# Altium schematic sheet heater_control.SchDoc: Heater Control
size Tabloid; DocumentNumber: LM-003; Revision: 3.0; SheetNumber: 6; SheetTotal: 11
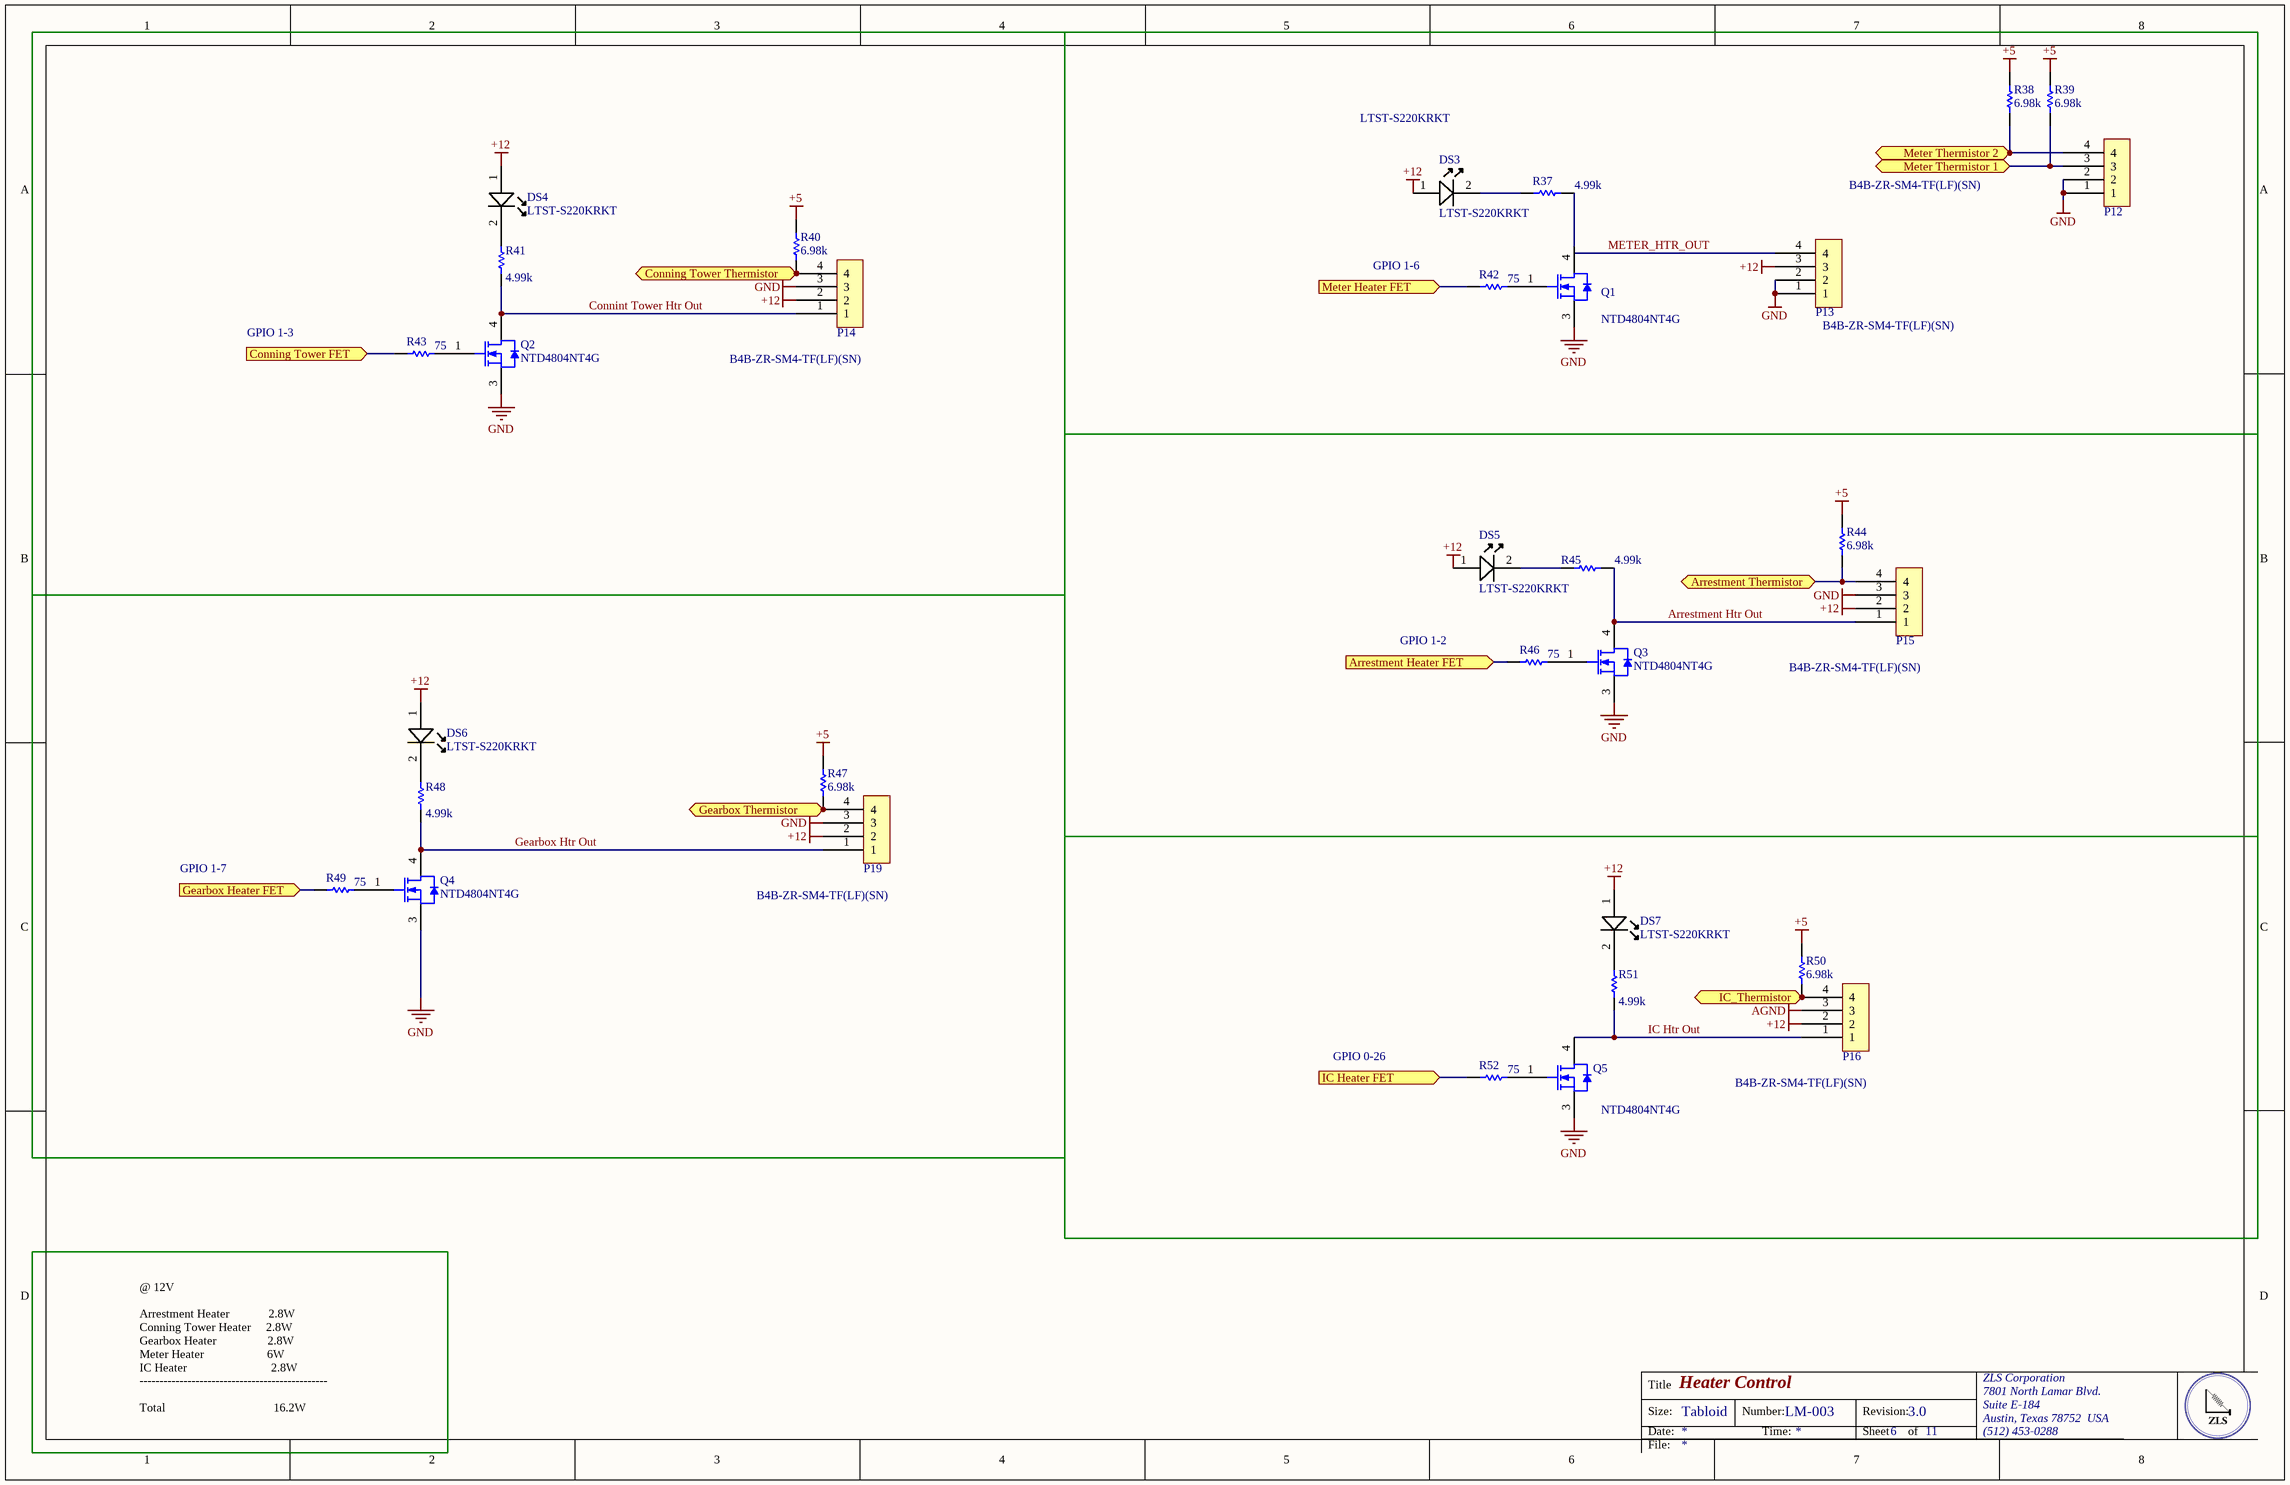
[diagram p0: heater_control.SchDoc]

## Parts
DS3  Manufacturer Part Number: LTST-S220KRKT  [0805C_L]  (hidden comment: Visible Name Value Type    False Description Lite-On LTST-S220KRKT Red LED, 631 nm 2012 (0805) Side View, Rectangle Lens SMD package STRING)
DS4  Manufacturer Part Number: LTST-S220KRKT  [0805C_L]  (hidden comment: Visible Name Value Type    False Description Lite-On LTST-S220KRKT Red LED, 631 nm 2012 (0805) Side View, Rectangle Lens SMD package STRING)
DS5  Manufacturer Part Number: LTST-S220KRKT  [0805C_L]  (hidden comment: Visible Name Value Type    False Description Lite-On LTST-S220KRKT Red LED, 631 nm 2012 (0805) Side View, Rectangle Lens SMD package STRING)
DS6  Manufacturer Part Number: LTST-S220KRKT  [0805C_L]  (hidden comment: Visible Name Value Type    False Description Lite-On LTST-S220KRKT Red LED, 631 nm 2012 (0805) Side View, Rectangle Lens SMD package STRING)
DS7  Manufacturer Part Number: LTST-S220KRKT  [0805C_L]  (hidden comment: Visible Name Value Type    False Description Lite-On LTST-S220KRKT Red LED, 631 nm 2012 (0805) Side View, Rectangle Lens SMD package STRING)
P12  Manufacturer Part Number: B4B-ZR-SM4-TF(LF)(SN)  [B4B-ZR-SM4-TF]  (hidden comment: CONN HEADER ZH TOP 4POS 1.5MM)
P13  Manufacturer Part Number: B4B-ZR-SM4-TF(LF)(SN)  [B4B-ZR-SM4-TF]  (hidden comment: CONN HEADER ZH TOP 4POS 1.5MM)
P14  Manufacturer Part Number: B4B-ZR-SM4-TF(LF)(SN)  [B4B-ZR-SM4-TF]  (hidden comment: CONN HEADER ZH TOP 4POS 1.5MM)
P15  Manufacturer Part Number: B4B-ZR-SM4-TF(LF)(SN)  [B4B-ZR-SM4-TF]  (hidden comment: CONN HEADER ZH TOP 4POS 1.5MM)
P16  Manufacturer Part Number: B4B-ZR-SM4-TF(LF)(SN)  [B4B-ZR-SM4-TF]  (hidden comment: CONN HEADER ZH TOP 4POS 1.5MM)
P19  Manufacturer Part Number: B4B-ZR-SM4-TF(LF)(SN)  [B4B-ZR-SM4-TF]  (hidden comment: CONN HEADER ZH TOP 4POS 1.5MM)
Q1  NTD4804NT4G  [ONSC-DPAK-3-369AA-01_V]
Q2  NTD4804NT4G  [ONSC-DPAK-3-369AA-01_V]
Q3  NTD4804NT4G  [ONSC-DPAK-3-369AA-01_V]
Q4  NTD4804NT4G  [ONSC-DPAK-3-369AA-01_V]
Q5  NTD4804NT4G  [ONSC-DPAK-3-369AA-01_V]
R37  Resistance (Ohms): 4.99k  [RESC0805(2012)_L]
R38  Resistance (Ohms): 6.98k  [RESC0805(2012)_N]  (hidden comment: 6K98 1% 0805(2012))
R39  Resistance (Ohms): 6.98k  [RESC0805(2012)_N]  (hidden comment: 6K98 1% 0805(2012))
R40  Resistance (Ohms): 6.98k  [RESC0805(2012)_N]  (hidden comment: 6K98 1% 0805(2012))
R41  Resistance (Ohms): 4.99k  [RESC0805(2012)_L]
R42  Resistance (Ohms): 75  [RESC0805(2012)_L]
R43  Resistance (Ohms): 75  [RESC0805(2012)_L]
R44  Resistance (Ohms): 6.98k  [RESC0805(2012)_N]  (hidden comment: 6K98 1% 0805(2012))
R45  Resistance (Ohms): 4.99k  [RESC0805(2012)_L]
R46  Resistance (Ohms): 75  [RESC0805(2012)_L]
R47  Resistance (Ohms): 6.98k  [RESC0805(2012)_N]  (hidden comment: 6K98 1% 0805(2012))
R48  Resistance (Ohms): 4.99k  [RESC0805(2012)_L]
R49  Resistance (Ohms): 75  [RESC0805(2012)_L]
R50  Resistance (Ohms): 6.98k  [RESC0805(2012)_N]  (hidden comment: 6K98 1% 0805(2012))
R51  Resistance (Ohms): 4.99k  [RESC0805(2012)_L]
R52  Resistance (Ohms): 75  [RESC0805(2012)_L]

## Blocks framed on the sheet
GPIO 1-3: DS4 P14 Q2 R40 R41 R43
GPIO 1-2: DS5 P15 Q3 R44-R46
GPIO 1-7: DS6 P19 Q4 R47-R49
GPIO 0-26: DS7 P16 Q5 R50-R52

## Ports
Arrestment Heater FET (in), Arrestment Thermistor, Conning Tower FET (in), Conning Tower Thermistor (out), Gearbox Heater FET (in), Gearbox Thermistor (out), IC Heater FET (in), IC_Thermistor, Meter Heater FET (in), Meter Thermistor 1, Meter Thermistor 2

## Nets
+5: R38.1 R39.2 R40.2 R44.1 R47.2 R50.1
+12: DS3.1(A) DS4.1(A) DS5.1(A) DS6.1(A) DS7.1(A) P13.3 P14.2 P15.2 P16.2 P19.2
AGND: P16.3
GND: P12.1 P12.2 P13.1 P13.2 P14.3 P15.3 P19.3 Q1.3(S) Q2.3(S) Q3.3(S) Q4.3(S) Q5.3(S)
Arrestment Heater FET: R46.1 ; port Arrestment Heater FET
Arrestment Htr Out: P15.1 Q3.4(D) R45.2
Arrestment Thermistor: P15.4 R44.2 ; port Arrestment Thermistor
Conning Tower FET: R43.1 ; port Conning Tower FET
Conning Tower Thermistor: P14.4 R40.1 ; port Conning Tower Thermistor
Connint Tower Htr Out: P14.1 Q2.4(D) R41.1
Gearbox Heater FET: R49.1 ; port Gearbox Heater FET
Gearbox Htr Out: P19.1 Q4.4(D) R48.1
Gearbox Thermistor: P19.4 R47.1 ; port Gearbox Thermistor
IC Heater FET: R52.1 ; port IC Heater FET
IC Htr Out: P16.1 Q5.4(D) R51.2
IC_Thermistor: P16.4 R50.2 ; port IC_Thermistor
Meter Heater FET: R42.1 ; port Meter Heater FET
Meter Thermistor 1: P12.3 R39.1 ; port Meter Thermistor 1
Meter Thermistor 2: P12.4 R38.2 ; port Meter Thermistor 2
METER_HTR_OUT: P13.4
NetDS3_2: DS3.2(K) R37.1
NetDS4_2: DS4.2(K) R41.2
NetDS5_2: DS5.2(K) R45.1
NetDS6_2: DS6.2(K) R48.2
NetDS7_2: DS7.2(K) R51.1
NetQ1_1: Q1.1(G) R42.2
NetQ1_4: Q1.4(D) R37.2
NetQ2_1: Q2.1(G) R43.2
NetQ3_1: Q3.1(G) R46.2
NetQ4_1: Q4.1(G) R49.2
NetQ5_1: Q5.1(G) R52.2

Not connected (* = marked no-connect by the designer): P12 5 6; P13 5 6; P14 5 6; P15 5 6; P16 5 6; P19 5 6

## Notes on the sheet
- LTST-S220KRKT
- GPIO 1-6
- @ 12V
  Arrestment Heater             2.8W
  Conning Tower Heater     2.8W
  Gearbox Heater                 2.8W
  Meter Heater                     6W
  IC Heater                            2.8W
  -----------------------------------------------
  Total                                    16.2W
- Title
- Size:
- Date:
- Tabloid
- Number:
- Time:
- Revision:
- Sheet
- of
- ZLS Corporation
- 7801 North Lamar Blvd.
- Suite E-184
- Austin, Texas 78752  USA
- (512) 453-0288
- File:

## Library data of the parts
DS3-DS7 = LED A/K: Manufacturer: Vishay / Lite-On; Lens Colour: Colorless; Lens Style: Diffused,Colorless; Viewing Angle: 130°; Luminous Intensity: 54mcd; Forward Current: 20mA; Forward Voltage: 2V; Power Rating: 75mW; Dominant Wavelength: 631nm; Lens Transparency: Clear; Number of Elements: 1; Wavelength: 639nm; Supplier 1: Digi-Key; Supplier Part Number 1: 160-1469-1-ND; Stock 1: 108191; Pricing 1: 1=0.31, 10=0.225, 25=0.1656, 100=0.1183, 250=0.0804, 500=0.071, 1000=0.0556 (USD); Mount: Surface Mount; Case/Package: 0805; Number of Pins: 2; Colour: Red; Case Code (Metric): 2012; Case Code (Imperial): 0805; Min Operating Temperature: -55°C; Max Operating Temperature: 85°C; Packaging: Tape and Reel; Package Quantity: 4000; Illumination Colour: Red; Test Current: 20mA; Power Dissipation: 75mW; Number of LEDs: 1; Length: 2.1mm; Height: 0.6mm; Width: 1mm; Depth: 0.6mm; Radiation Hardening: No; Lead Free: Lead Free; ComponentLink1URL: https://datasheet.ciiva.com/2110/s-110-ltst-s220krkt-2110132.pdf; ComponentLink1Description: https://datasheet.ciiva.com/2110/s-110-ltst-s220krkt-2110132.pdf; ComponentLink2URL: https://datasheet.ciiva.com/2110/s-110-ltst-s220krkt-2110133.pdf; ComponentLink2Description: https://datasheet.ciiva.com/2110/s-110-ltst-s220krkt-2110133.pdf; ComponentLink3URL: https://datasheet.ciiva.com/2110/s-110-ltst-s220krkt-2110134.pdf; ComponentLink3Description: https://datasheet.ciiva.com/2110/s-110-ltst-s220krkt-2110134.pdf; ComponentLink4URL: https://datasheet.ciiva.com/12403/lite-on-ltst-s220krkt-187389-12403798.pdf; ComponentLink4Description: https://datasheet.ciiva.com/12403/lite-on-ltst-s220krkt-187389-12403798.pdf; ComponentLink5URL: https://datasheet.ciiva.com/16345/lite-onltst-s220krkt-16345511.pdf; ComponentLink5Description: https://datasheet.ciiva.com/16345/lite-onltst-s220krkt-16345511.pdf; ComponentLink6URL: https://datasheet.ciiva.com/15118/getdatasheetpartid-225752-15118120.pdf; ComponentLink6Description: https://datasheet.ciiva.com/15118/getdatasheetpartid-225752-15118120.pdf; ComponentLink7URL: https://datasheet.ciiva.com/14633/0900766b80dc0b76-14633737.pdf; ComponentLink7Description: https://datasheet.ciiva.com/14633/0900766b80dc0b76-14633737.pdf; ComponentLink8URL: https://datasheet.ciiva.com/11775/0900766b80dc0b76-11775439.pdf; ComponentLink8Description: https://datasheet.ciiva.com/11775/0900766b80dc0b76-11775439.pdf
P12-P16 P19 = B4B-ZR-SM4-TF: Manufacturer: JST Sales America Inc.; Pitch - Mating: 0.059" (1.50mm); Style: Board to Cable/Wire; Shrouding: Shrouded - 4 Wall; Number of Positions: 4; Number of Positions Loaded: All; Material Flammability Rating: UL94 V-0; Current Rating: 1A; Voltage Rating: 50V; Mated Stacking Heights: 6.4mm; Supplier 1: Digi-Key; Supplier Part Number 1: 455-1683-1-ND; RoHS: RoHS Compliant; Category: Connectors, Interconnects; Stock 1: 38430; Pricing 1: 1=0.71, 10=0.67, 100=0.5138, 500=0.44682 (USD); Packaging: Cut Tape (CT); Part Status: Active; Connector Type: Header; Contact Type: Male Pin; Number of Rows: 1; Row Spacing - Mating: -; Mounting Type: Surface Mount; Termination: Solder; Fastening Type: Detent Lock; Contact Length - Mating: -; Contact Length - Post: -; Overall Contact Length: -; Insulation Height: 0.197" (5.00mm); Contact Shape: Circular; Contact Finish - Mating: Tin; Contact Finish Thickness - Mating: -; Contact Finish - Post: Tin; Contact Material: Brass; Insulation Material: Polyamide (PA6T), Nylon 6T, Glass Filled; Features: Solder Retention; Operating Temperature: -25°C ~ 85°C; Ingress Protection: -; Insulation Color: Natural; Contact Finish Thickness - Post: -; Applications: -; ComponentLink1URL: http://www.jst-mfg.com/product/pdf/eng/eZH.pdf; ComponentLink1Description: http://www.jst-mfg.com/product/pdf/eng/eZH.pdf
Q1-Q5 = CMP-1058-00341-1: Power MOSFET, 30 V, 117 A, Single N-Channel, 3-Pin DPAK, Pb-Free, Tape and Reel; Manufacturer: On Semiconductor; Coss Typ (pF): 952; Qrr Typ (nC): 30; VGS Max (V): 20; ID Max (A): 117; Crss Typ (pF): 556; Channel Polarity: N Channel; Ciss Typ (pF): 4490; VGS(th) Max (V): 2.5; ComponentLink2Description: Datasheet; ComponentLink3Description: Package Specification; Mounting Technology: Surface Mount; PackageDescription: 3-Pin Flange Mount, Body 6.54 x 6.095 mm, Pitch 2.29 mm; PackageVersion: Rev. B, 06/2010; PartNumber: NTD4804NT4G; ComponentLink2URL: http://www.onsemi.cn/pub_link/Collateral/NTD4804N-D.PDF; RoHS: Pb-Free; Configuration: Single; DatasheetVersion: Rev. 8; PackageReference: DPAK-3-369AA-01; ComponentLink3URL: http://www.onsemi.cn/pub_link/Collateral/369AA.PDF; ComponentLink1Description: Manufacturer URL; Packing: Tape and Reel; Package Type: DPAK-3; ComponentLink1URL: http://www.onsemi.com/; V(BR)DSS Min (V): 30; Supplier 1: Digi-Key; Supplier Part Number 1: NTD4804NT4GOSDKR-ND
R37 R41 R45 R48 R51 = CMP-1013-00393-1: Manufacturer: Vishay Dale; Manufacturer Part Number: CRCW08054K99FKEA; Tolerance: ±1%; Power (Watts): 0.125W, 1/8W; Temperature Coefficient: ±100ppm/°C; Supplier 1: Digi-Key; Supplier Part Number 1: 541-4.99KCCT-ND; RoHS: RoHS Compliant; Category: Resistors; Stock 1: 93740; Pricing 1: 1=0.1, 10=0.044, 100=0.0178, 1000=0.00802, 2500=0.00696 (USD); Packaging: Cut Tape (CT); Part Status: Active; Composition: Thick Film; Features: Automotive AEC-Q200; Operating Temperature: -55°C ~ 155°C; Package / Case: 0805 (2012 Metric); Supplier Device Package: 0805; Size / Dimension: 0.079" L x 0.049" W (2.00mm x 1.25mm); Height - Seated (Max): 0.020" (0.50mm); Failure Rate: -; ComponentLink1URL: http://www.vishay.com/docs/20035/dcrcwe3.pdf; ComponentLink1Description: http://www.vishay.com/docs/20035/dcrcwe3.pdf
R38-R40 R44 R47 R50 = CMP-1013-00606-1: 6K98 0.125W 1% 0805 (2012 Metric)  SMD; Manufacturer: Vishay Dale; Manufacturer Part Number: CRCW08056K98FKEA; Power (Watts): 0.125W, 1/8W; Temperature Coefficient: ±100ppm/°C; Supplier 1: Digi-Key; Supplier Part Number 1: 541-6.98KCCT-ND; RoHS: RoHS Compliant; Category: Resistors; Stock 1: 34245; Pricing 1: 1=0.1, 10=0.044, 100=0.0178, 1000=0.00802, 2500=0.00696 (USD); Packaging: Cut Tape (CT); Part Status: Active; Tolerance: ±1%; Composition: Thick Film; Features: Automotive AEC-Q200; Operating Temperature: -55°C ~ 155°C; Package / Case: 0805 (2012 Metric); Supplier Device Package: 0805; Size / Dimension: 0.079" L x 0.049" W (2.00mm x 1.25mm); Height - Seated (Max): 0.020" (0.50mm); Failure Rate: -; ComponentLink1URL: http://www.vishay.com/docs/20035/dcrcwe3.pdf; ComponentLink1Description: http://www.vishay.com/docs/20035/dcrcwe3.pdf
R42 R43 R46 R49 R52 = CMP-1013-00393-1: Manufacturer: Vishay Dale; Manufacturer Part Number: CRCW080575R0FKEA; Tolerance: ±1%; Power (Watts): 0.125W, 1/8W; Temperature Coefficient: ±100ppm/°C; Supplier 1: Digi-Key; Supplier Part Number 1: 541-75.0CCT-ND; RoHS: RoHS Compliant; Category: Resistors; Stock 1: 32546; Pricing 1: 1=0.1, 10=0.044, 100=0.0178, 1000=0.00802, 2500=0.00696 (USD); Packaging: Cut Tape (CT); Part Status: Active; Composition: Thick Film; Features: Automotive AEC-Q200; Operating Temperature: -55°C ~ 155°C; Package / Case: 0805 (2012 Metric); Supplier Device Package: 0805; Size / Dimension: 0.079" L x 0.049" W (2.00mm x 1.25mm); Height - Seated (Max): 0.020" (0.50mm); Failure Rate: -; ComponentLink1URL: http://www.vishay.com/docs/20035/dcrcwe3.pdf; ComponentLink1Description: http://www.vishay.com/docs/20035/dcrcwe3.pdf